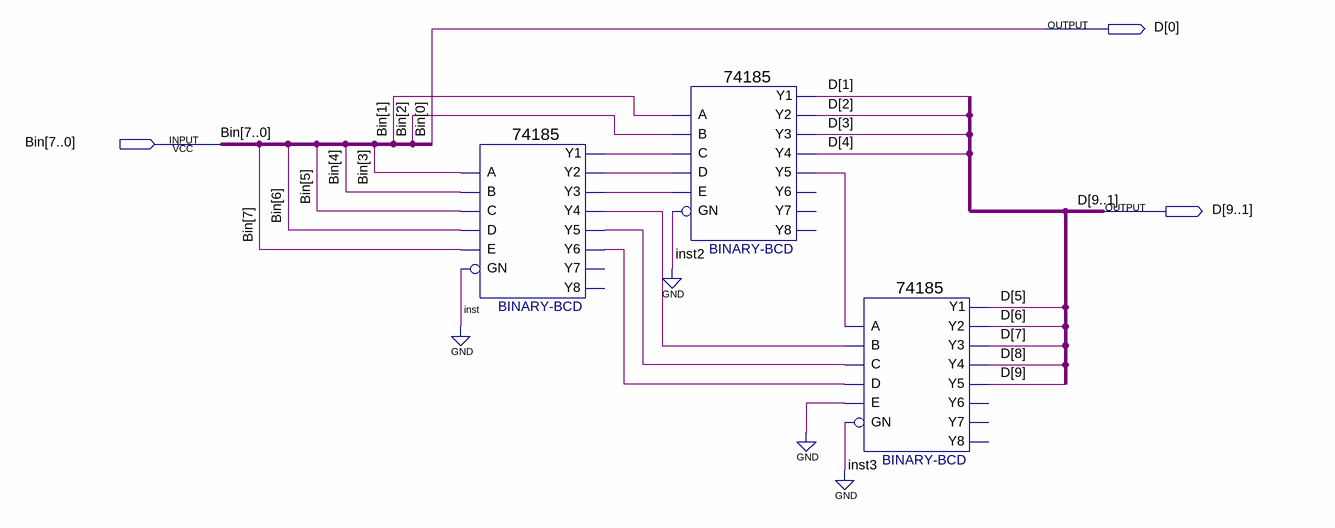
[diagram p0: schematic sheet]
// Quartus schematic bcd_converter.bdf as structural Verilog: 3 symbols, 3 pins
module bcd_converter (
  input  [7:0] Bin,
  output [9:0] D
);

  wire inst2_y5, inst_y1, inst_y2, inst_y3, inst_y4, inst_y5, inst_y6;

  \74185  inst (
    .A(Bin[3]), .B(Bin[4]), .D(Bin[6]), .C(Bin[5]), .E(Bin[7]), .GN(1'b0), .Y1(inst_y1), .Y3(inst_y3),
    .Y2(inst_y2), .Y5(inst_y5), .Y4(inst_y4), .Y6(inst_y6));  // open: Y8, Y7
  \74185  inst2 (
    .A(Bin[1]), .B(Bin[2]), .D(inst_y2), .C(inst_y1), .E(inst_y3), .GN(1'b0), .Y1(D[1]), .Y3(D[3]),
    .Y2(D[2]), .Y5(inst2_y5), .Y4(D[4]));  // open: Y6, Y8, Y7
  \74185  inst3 (
    .A(inst2_y5), .B(inst_y4), .D(inst_y6), .C(inst_y5), .E(1'b0), .GN(1'b0), .Y1(D[5]), .Y3(D[7]),
    .Y2(D[6]), .Y5(D[9]), .Y4(D[8]));  // open: Y6, Y8, Y7

  assign D[0] = Bin[0];
endmodule
